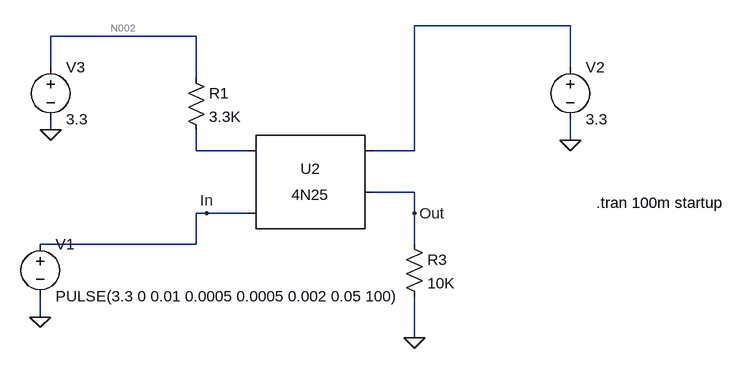
[diagram p0: schematic RayWindPulseIsolator.asc]
RayWindPulseIsolator.asc, the LTspice schematic file:
Version 4
SHEET 1 880 680
WIRE 608 80 368 80
WIRE 32 96 -192 96
WIRE -192 144 -192 96
WIRE 608 144 608 80
WIRE 32 160 32 96
WIRE -192 240 -192 224
WIRE 608 256 608 224
WIRE 32 272 32 240
WIRE 112 272 32 272
WIRE 368 272 368 80
WIRE 368 272 304 272
WIRE 368 336 304 336
WIRE 48 368 32 368
WIRE 112 368 48 368
WIRE 368 368 368 336
WIRE 32 416 32 368
WIRE 32 416 -208 416
WIRE 368 416 368 368
WIRE -208 528 -208 496
WIRE 368 560 368 496
FLAG 608 256 0
FLAG 368 560 0
FLAG -208 528 0
FLAG 368 368 Out
FLAG -192 240 0
FLAG 48 368 In
SYMBOL res 16 144 R0
SYMATTR InstName R1
SYMATTR Value 3.3K
SYMBOL res 352 400 R0
SYMATTR InstName R3
SYMATTR Value 10K
SYMBOL voltage -208 400 R0
SYMATTR InstName V1
SYMATTR Value PULSE(3.3 0 0.01 0.0005 0.0005 0.002 0.05 100)
SYMBOL voltage 608 128 R0
SYMATTR InstName V2
SYMATTR Value 3.3
SYMBOL voltage -192 128 R0
SYMATTR InstName V3
SYMATTR Value 3.3
SYMBOL Optos/4N25 208 336 R0
SYMATTR InstName U2
TEXT 648 352 Left 2 !.tran 100m startup

The netlist it stands for:
* RayWindPulseIsolator.asc
R1 N002 N003 3.3K
R3 Out 0 10K
V1 In 0 PULSE(3.3 0 0.01 0.0005 0.0005 0.002 0.05 100)
V2 N001 0 3.3
V3 N002 0 3.3
XU2 N003 In N001 Out NC_01 4N25
.tran 100m startup
.lib 4N25.sub
.backanno
.end

* Results of the author's LTspice run, read from the files saved beside the schematic
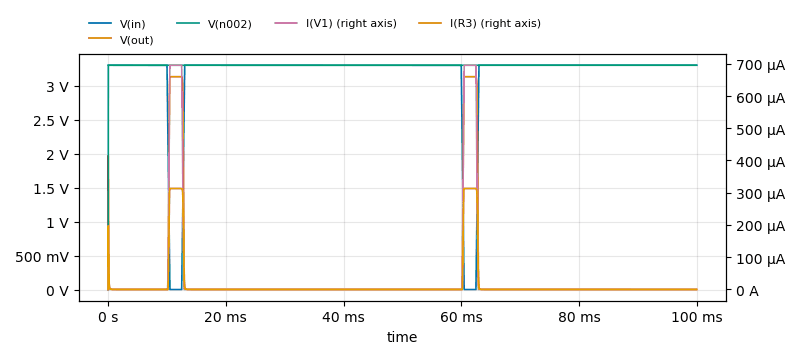
[diagram p1: Transient Analysis of RayWindPulseIsolator.asc, plotted from the saved traces]
* Transient Analysis, 1 run:
*   V(in): min 0 V, max 3.3 V, average 3.135 V, rms 3.211 V, last 3.3 V
*   V(out): min 0 V, max 3.131 V, average 157.3 mV, rms 687.3 mV, last 3.46 µV
*   V(n002): min 0 V, max 3.3 V, average 3.3 V, rms 3.3 V, last 3.3 V
*   I(V1): min -282.3 nA, max 695.6 µA, average 32.82 µA, rms 147.2 µA, last 0 A
*   I(R3): min 0 A, max 313.1 µA, average 15.73 µA, rms 68.73 µA, last 346 pA